# EAGLE schematic Arduino MEGA blank shield (EAGLE 6.5.0)
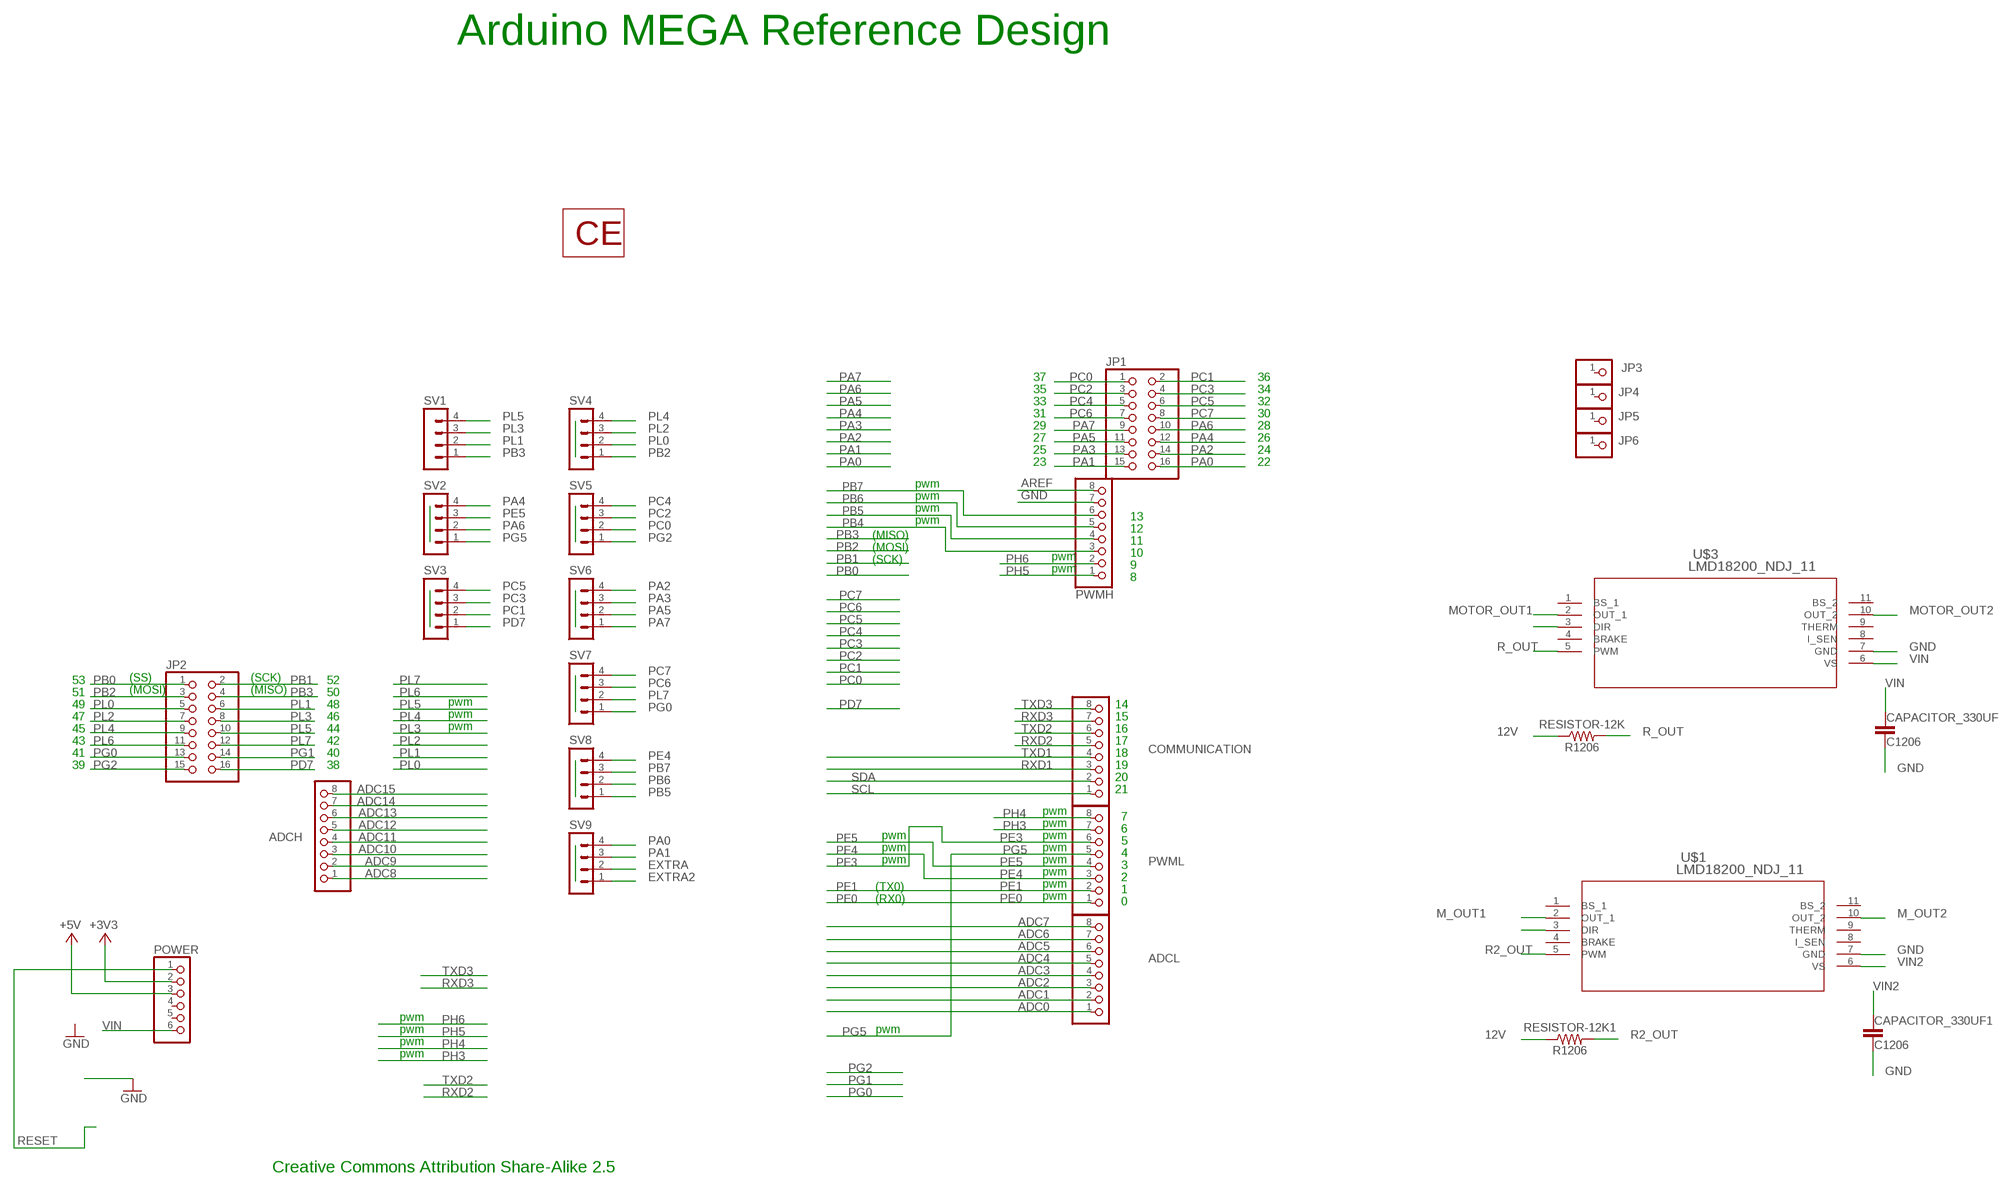
[diagram p0: schematic, sheet 1]

## Parts
ADCH  PINHD-1X8  [1X08]
ADCL  PINHD-1X8  [1X08]
CAPACITOR_330UF  C1206  [C1206]
CAPACITOR_330UF1  C1206  [C1206]
COMMUNICATION  PINHD-1X8  [1X08]
JP1  PINHD-2X8  [2X08]
JP2  PINHD-2X8  [2X08]
JP3  PINHD-1X1  [1X01]
JP4  PINHD-1X1  [1X01]
JP5  PINHD-1X1  [1X01]
JP6  PINHD-1X1  [1X01]
POWER  PINHD-1X6  [1X06]
PWMH  PINHD-1X8  [1X08]
PWML  PINHD-1X8  [1X08]
RESISTOR-12K  R1206  [R1206]
RESISTOR-12K1  R1206  [R1206]
SV1  MA04-1  [MA04-1]
SV2  MA04-1  [MA04-1]
SV3  MA04-1  [MA04-1]
SV4  MA04-1  [MA04-1]
SV5  MA04-1  [MA04-1]
SV6  MA04-1  [MA04-1]
SV7  MA04-1  [MA04-1]
SV8  MA04-1  [MA04-1]
SV9  MA04-1  [MA04-1]
U$1  LMD18200_NDJ_11  [TA11B]
U$3  LMD18200_NDJ_11  [TA11B]
U$4  CE  [CE-COPPER]

## Nets
12V [gnd]: RESISTOR-12K1.1 RESISTOR-12K.1
+3V3 [power]: POWER.2
+5V [usbvcc]: POWER.3
ADC0: ADCL.1
ADC1: ADCL.2
ADC2: ADCL.3
ADC3: ADCL.4
ADC4: ADCL.5
ADC5: ADCL.6
ADC6: ADCL.7
ADC7: ADCL.8
ADC8: ADCH.1
ADC9: ADCH.2
ADC10: ADCH.3
ADC11: ADCH.4
ADC12: ADCH.5
ADC13: ADCH.6
ADC14: ADCH.7
ADC15: ADCH.8
AREF: PWMH.8
EXTRA: SV9.2
EXTRA2: SV9.1
GND [gnd]: CAPACITOR_330UF1.2 CAPACITOR_330UF.2 PWMH.7 U$1.7(GND) U$3.7(GND)
M_OUT1: U$1.2(OUT_1)
M_OUT2: U$1.10(OUT_2)
MOTOR_OUT1: U$3.2(OUT_1)
MOTOR_OUT2: U$3.10(OUT_2)
N$1: U$1.3(DIR)
N$6: U$3.3(DIR)
PA0: JP1.16 SV9.4
PA1: JP1.15 SV9.3
PA2: JP1.14 SV6.4
PA3: JP1.13 SV6.3
PA4: JP1.12 SV2.4
PA5: JP1.11 SV6.2
PA6: JP1.10 SV2.2
PA7: JP1.9 SV6.1
PB0: JP2.1
PB1: JP2.2
PB2: JP2.3 SV4.1
PB3: JP2.4 SV1.1
PB4: PWMH.3
PB5: PWMH.4 SV8.1
PB6: PWMH.5 SV8.2
PB7: PWMH.6 SV8.3
PC0: JP1.1 SV5.2
PC1: JP1.2 SV3.2
PC2: JP1.3 SV5.3
PC3: JP1.4 SV3.3
PC4: JP1.5 SV5.4
PC5: JP1.6 SV3.4
PC6: JP1.7 SV7.3
PC7: JP1.8 SV7.4
PD7: JP2.16 SV3.1
PE0: PWML.1
PE1: PWML.2
PE3: PWML.6
PE4: PWML.3 SV8.4
PE5: PWML.4 SV2.3
PG0: JP2.13 SV7.1
PG1: JP2.14
PG2: JP2.15 SV5.1
PG5: PWML.5 SV2.1
PH3: PWML.7
PH4: PWML.8
PH5: PWMH.1
PH6: PWMH.2
PL0: JP2.5 SV4.2
PL1: JP2.6 SV1.2
PL2: JP2.7 SV4.3
PL3: JP2.8 SV1.3
PL4: JP2.9 SV4.4
PL5: JP2.10 SV1.4
PL6: JP2.11
PL7: JP2.12 SV7.2
R2_OUT: RESISTOR-12K1.2 U$1.5(PWM)
R_OUT: RESISTOR-12K.2 U$3.5(PWM)
RESET: POWER.1
RXD1: COMMUNICATION.3
RXD2: COMMUNICATION.5
RXD3: COMMUNICATION.7
SCL: COMMUNICATION.1
SDA: COMMUNICATION.2
TXD1: COMMUNICATION.4
TXD2: COMMUNICATION.6
TXD3: COMMUNICATION.8
VIN [power]: CAPACITOR_330UF.1 POWER.6 U$3.6(VS)
VIN2 [power]: CAPACITOR_330UF1.1 U$1.6(VS)
Unconnected: JP3.1 JP4.1 JP5.1 JP6.1 POWER.4 POWER.5 U$1.1(BS_1) U$1.4(BRAKE) U$1.8(I_SEN) U$1.9(THERM) U$1.11(BS_2) U$3.1(BS_1) U$3.4(BRAKE) U$3.8(I_SEN) U$3.9(THERM) U$3.11(BS_2)

## Notes on the sheet
- Arduino MEGA Reference Design
- 37 | 36
- 35 | 34
- 33 | 32
- 31 | 30
- 29 | 28
- 27 | 26
- 25 | 24
- 23 | 22
- pwm
- pwm
- pwm
- pwm | 13
- 12
- (MISO)
- 11
- (MOSI)
- pwm | 10
- (SCK)
- pwm | 9
- 8
- 53 | (SS) | (SCK) | 52
- 51 | (MOSI) | (MISO) | 50
- 49 | 48 | pwm | 14
- 47 | 46 | pwm | 15
- 45 | 44 | pwm | 16
- 43 | 42 | 17
- 41 | 40 | 18
- 39 | 38 | 19
- 20
- 21
- pwm
- 7
- pwm
- 6
- pwm | pwm
- 5
- pwm | pwm
- 4
- pwm | pwm
- 3
- pwm
- 2
- (TX0) | pwm
- 1
- (RX0) | pwm
- 0
- pwm
- pwm | pwm
- pwm
- pwm
- Creative Commons Attribution Share-Alike 2.5

## Library data of the parts
ADCH ADCL COMMUNICATION PWMH PWML = pinhead:PINHD-1X8: PIN HEADER
CAPACITOR_330UF CAPACITOR_330UF1 = Brians_Library:C1206: CAPACITOR 1206 Packaging
JP1 JP2 = pinhead:PINHD-2X8: PIN HEADER
JP3-JP6 = pinhead:PINHD-1X1: PIN HEADER
POWER = pinhead:PINHD-1X6: PIN HEADER
RESISTOR-12K RESISTOR-12K1 = Brians_Library:R1206: Surface mount resistor, 1206 package
SV1-SV9 = con-lstb:MA04-1: PIN HEADER; OC_FARNELL: unknown; OC_NEWARK: unknown
U$1 U$3 = IEEELMD18200t:LMD18200_NDJ_11; MANUFACTURER_PART_NUMBER: lmd18200tnopb; VENDOR: National
U$4 = SmartPrj:CE

## Net classes
0 default: width 0.203 mm, drill 0.406 mm, clearance 0.203 mm
1 power: width 0.61 mm, drill 0.711 mm, clearance 0.203 mm
2 gnd: width 0.305 mm, drill 0.711 mm, clearance 0.203 mm
3 usbvcc: width 0.508 mm, drill 0.711 mm, clearance 0.203 mm